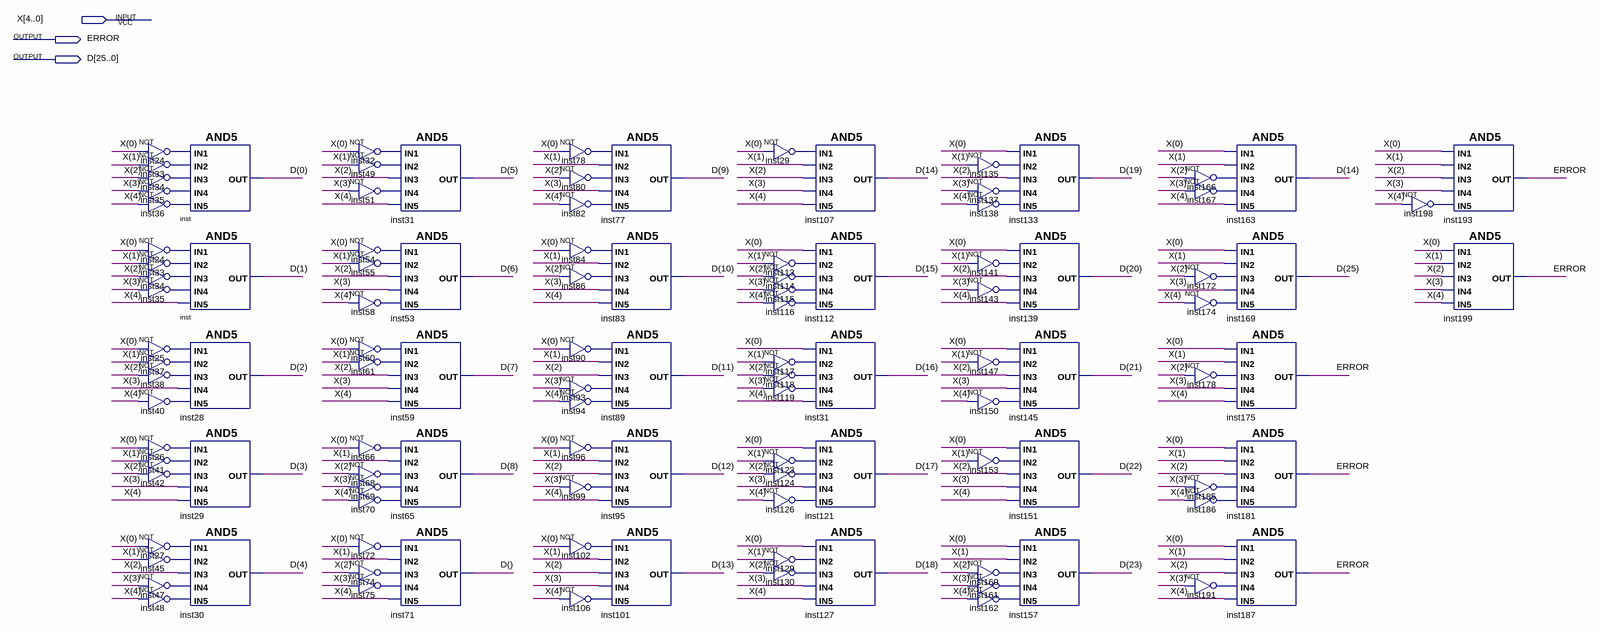
[diagram p0: schematic sheet]
// Quartus schematic g47_5_26_Decoder.bdf as structural Verilog: 112 symbols, 3 pins
module g47_5_26_Decoder (
  input  [4:0] X,
  output ERROR,
  output [25:0] D
);

  wire \D(0) , \D(1) , \D(2) , \D(3) , \D(4) , \D(5) , \D(6) , \D(7) , \D(8) , \D(9) , \D(10) , \D(11) ,
       \D(12) , \D(13) , \D(14) , \D(15) , \D(16) , \D(17) , \D(18) , \D(19) , \D(20) , \D(21) , \D(22) ,
       \D(23) , \D(25) , \D() , inst24_out, inst24_out_2, inst25_out, inst26_out, inst27_out, inst29_out,
       inst32_out, inst33_out, inst33_out_2, inst34_out, inst34_out_2, inst35_out, inst35_out_2, inst36_out,
       inst37_out, inst38_out, inst40_out, inst41_out, inst42_out, inst45_out, inst47_out, inst48_out,
       inst49_out, inst51_out, inst54_out, inst55_out, inst58_out, inst60_out, inst61_out, inst66_out,
       inst68_out, inst69_out, inst70_out, inst72_out, inst74_out, inst75_out, inst78_out, inst80_out,
       inst82_out, inst84_out, inst86_out, inst90_out, inst93_out, inst94_out, inst96_out, inst99_out,
       inst102_out, inst106_out, inst113_out, inst114_out, inst115_out, inst116_out, inst117_out,
       inst118_out, inst119_out, inst123_out, inst124_out, inst126_out, inst129_out, inst130_out,
       inst135_out, inst137_out, inst138_out, inst141_out, inst143_out, inst147_out, inst150_out,
       inst153_out, inst160_out, inst161_out, inst162_out, inst166_out, inst167_out, inst172_out,
       inst174_out, inst178_out, inst185_out, inst186_out, inst191_out, inst198_out, \X(0) , \X(1) , \X(2) ,
       \X(3) , \X(4) ;

  not inst24 (inst24_out_2, \X(0) );
  not inst33 (inst33_out_2, \X(1) );
  not inst34 (inst34_out_2, \X(2) );
  not inst35 (inst35_out_2, \X(3) );
  not inst36 (inst36_out, \X(4) );
  not inst24_dup2 (inst24_out, \X(0) );
  not inst33_dup2 (inst33_out, \X(1) );
  not inst34_dup2 (inst34_out, \X(2) );
  not inst35_dup2 (inst35_out, \X(3) );
  not inst25 (inst25_out, \X(0) );
  not inst37 (inst37_out, \X(1) );
  not inst38 (inst38_out, \X(2) );
  not inst40 (inst40_out, \X(4) );
  not inst26 (inst26_out, \X(0) );
  not inst41 (inst41_out, \X(1) );
  not inst42 (inst42_out, \X(2) );
  not inst27 (inst27_out, \X(0) );
  not inst45 (inst45_out, \X(1) );
  not inst47 (inst47_out, \X(3) );
  not inst48 (inst48_out, \X(4) );
  and inst (\D(0) , inst24_out_2, inst33_out_2, inst34_out_2, inst35_out_2, inst36_out);
  and inst_dup2 (\D(1) , inst24_out, inst33_out, inst34_out, inst35_out, \X(4) );
  and inst28 (\D(2) , inst25_out, inst37_out, inst38_out, \X(3) , inst40_out);
  and inst29 (\D(3) , inst26_out, inst41_out, inst42_out, \X(3) , \X(4) );
  and inst30 (\D(4) , inst27_out, inst45_out, \X(2) , inst47_out, inst48_out);
  not inst32 (inst32_out, \X(0) );
  not inst49 (inst49_out, \X(1) );
  not inst51 (inst51_out, \X(3) );
  not inst54 (inst54_out, \X(0) );
  not inst55 (inst55_out, \X(1) );
  not inst58 (inst58_out, \X(4) );
  not inst60 (inst60_out, \X(0) );
  not inst61 (inst61_out, \X(1) );
  not inst66 (inst66_out, \X(0) );
  not inst68 (inst68_out, \X(2) );
  not inst69 (inst69_out, \X(3) );
  not inst70 (inst70_out, \X(4) );
  not inst72 (inst72_out, \X(0) );
  not inst74 (inst74_out, \X(2) );
  not inst75 (inst75_out, \X(3) );
  and inst31 (\D(5) , inst32_out, inst49_out, \X(2) , inst51_out, \X(4) );
  and inst53 (\D(6) , inst54_out, inst55_out, \X(2) , \X(3) , inst58_out);
  and inst59 (\D(7) , inst60_out, inst61_out, \X(2) , \X(3) , \X(4) );
  and inst65 (\D(8) , inst66_out, \X(1) , inst68_out, inst69_out, inst70_out);
  and inst71 (\D() , inst72_out, \X(1) , inst74_out, inst75_out, \X(4) );
  not inst78 (inst78_out, \X(0) );
  not inst80 (inst80_out, \X(2) );
  not inst82 (inst82_out, \X(4) );
  not inst84 (inst84_out, \X(0) );
  not inst86 (inst86_out, \X(2) );
  not inst90 (inst90_out, \X(0) );
  not inst93 (inst93_out, \X(3) );
  not inst94 (inst94_out, \X(4) );
  not inst96 (inst96_out, \X(0) );
  not inst99 (inst99_out, \X(3) );
  not inst102 (inst102_out, \X(0) );
  not inst106 (inst106_out, \X(4) );
  and inst77 (\D(9) , inst78_out, \X(1) , inst80_out, \X(3) , inst82_out);
  and inst83 (\D(10) , inst84_out, \X(1) , inst86_out, \X(3) , \X(4) );
  and inst89 (\D(11) , inst90_out, \X(1) , \X(2) , inst93_out, inst94_out);
  and inst95 (\D(12) , inst96_out, \X(1) , \X(2) , inst99_out, \X(4) );
  and inst101 (\D(13) , inst102_out, \X(1) , \X(2) , \X(3) , inst106_out);
  not inst29_dup2 (inst29_out, \X(0) );
  not inst113 (inst113_out, \X(1) );
  not inst114 (inst114_out, \X(2) );
  not inst115 (inst115_out, \X(3) );
  not inst116 (inst116_out, \X(4) );
  not inst117 (inst117_out, \X(1) );
  not inst118 (inst118_out, \X(2) );
  not inst119 (inst119_out, \X(3) );
  not inst123 (inst123_out, \X(1) );
  not inst124 (inst124_out, \X(2) );
  not inst126 (inst126_out, \X(4) );
  not inst129 (inst129_out, \X(1) );
  not inst130 (inst130_out, \X(2) );
  and inst107 (\D(14) , inst29_out, \X(1) , \X(2) , \X(3) , \X(4) );
  and inst112 (\D(15) , \X(0) , inst113_out, inst114_out, inst115_out, inst116_out);
  and inst31_dup2 (\D(16) , \X(0) , inst117_out, inst118_out, inst119_out, \X(4) );
  and inst121 (\D(17) , \X(0) , inst123_out, inst124_out, \X(3) , inst126_out);
  and inst127 (\D(18) , \X(0) , inst129_out, inst130_out, \X(3) , \X(4) );
  not inst135 (inst135_out, \X(1) );
  not inst137 (inst137_out, \X(3) );
  not inst138 (inst138_out, \X(4) );
  not inst141 (inst141_out, \X(1) );
  not inst143 (inst143_out, \X(3) );
  not inst147 (inst147_out, \X(1) );
  not inst150 (inst150_out, \X(4) );
  not inst153 (inst153_out, \X(1) );
  not inst160 (inst160_out, \X(2) );
  not inst161 (inst161_out, \X(3) );
  not inst162 (inst162_out, \X(4) );
  and inst133 (\D(19) , \X(0) , inst135_out, \X(2) , inst137_out, inst138_out);
  and inst139 (\D(20) , \X(0) , inst141_out, \X(2) , inst143_out, \X(4) );
  and inst145 (\D(21) , \X(0) , inst147_out, \X(2) , \X(3) , inst150_out);
  and inst151 (\D(22) , \X(0) , inst153_out, \X(2) , \X(3) , \X(4) );
  and inst157 (\D(23) , \X(0) , \X(1) , inst160_out, inst161_out, inst162_out);
  not inst166 (inst166_out, \X(2) );
  not inst167 (inst167_out, \X(3) );
  not inst172 (inst172_out, \X(2) );
  not inst174 (inst174_out, \X(4) );
  not inst178 (inst178_out, \X(2) );
  not inst185 (inst185_out, \X(3) );
  not inst186 (inst186_out, \X(4) );
  not inst191 (inst191_out, \X(3) );
  and inst163 (\D(14) , \X(0) , \X(1) , inst166_out, inst167_out, \X(4) );
  and inst169 (\D(25) , \X(0) , \X(1) , inst172_out, \X(3) , inst174_out);
  and inst175 (ERROR, \X(0) , \X(1) , inst178_out, \X(3) , \X(4) );
  and inst181 (ERROR, \X(0) , \X(1) , \X(2) , inst185_out, inst186_out);
  and inst187 (ERROR, \X(0) , \X(1) , \X(2) , inst191_out, \X(4) );
  not inst198 (inst198_out, \X(4) );
  and inst193 (ERROR, \X(0) , \X(1) , \X(2) , \X(3) , inst198_out);
  and inst199 (ERROR, \X(0) , \X(1) , \X(2) , \X(3) , \X(4) );
endmodule
